# Altium project Power Distribution Board - Componentes teydisa.PrjPcb
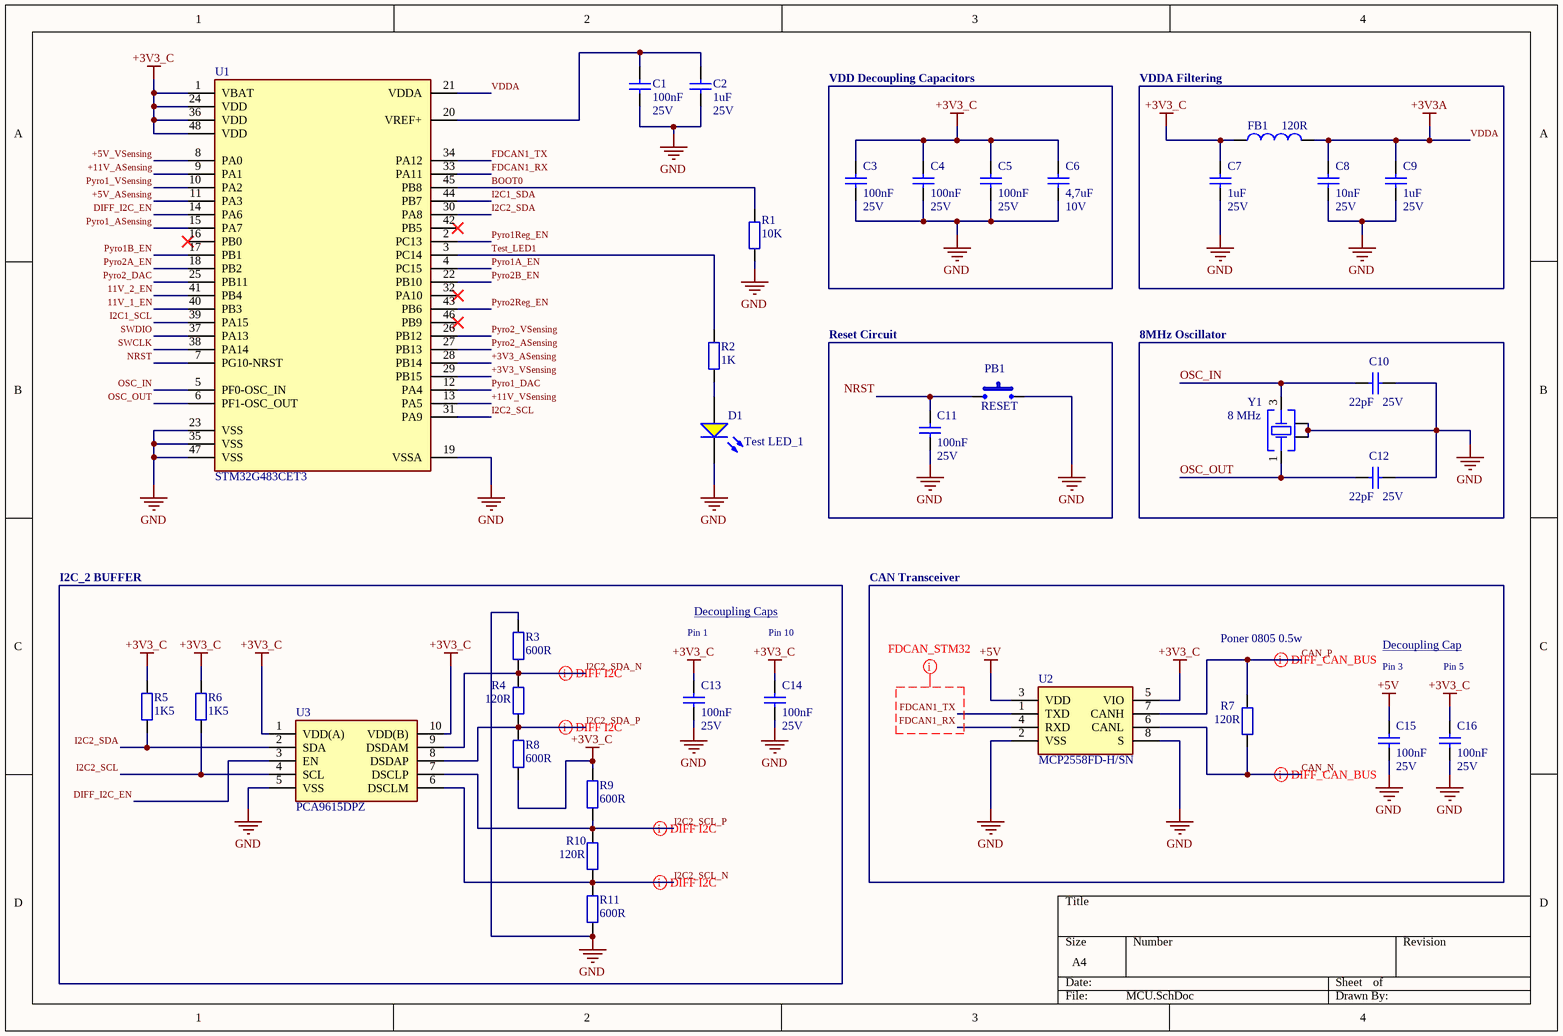
[diagram p0: MCU.SchDoc]
7 sheets, 206 parts. Net scope: global (net labels, ports and power ports of the same name join across sheets).
Board file: PCB_Power_Distribution.PcbDoc
Sheets:
  MCU.SchDoc
  Power Management.SchDoc
  Drogue Pyro.SchDoc
  Main Pyro.SchDoc
  Connectors.SchDoc
  Sensing.SchDoc
  Current Sensing.SchDoc

## Sheet MCU.SchDoc
size A4; SheetNumber: 1; SheetTotal: 7

### Parts
C1  value 100nF  Voltage: 25V  [MY_0603]  (hidden comment: Cap ceramic)
C2  value 1uF  Volte: 25V  [MY_0603]  (hidden comment: Cap ceramic)
C3  value 100nF  Voltage: 25V  [MY_0603]  (hidden comment: Cap ceramic)
C4  value 100nF  Voltage: 25V  [MY_0603]  (hidden comment: Cap ceramic)
C5  value 100nF  Voltage: 25V  [MY_0603]  (hidden comment: Cap ceramic)
C6  value 4,7uF  Volte: 10V  [MY_0603]  (hidden comment: Cap ceramic)
C7  value 1uF  Volte: 25V  [MY_0603]  (hidden comment: Cap ceramic)
C8  25V  value 10nF  [MY_0603]
C9  value 1uF  Volte: 25V  [MY_0603]  (hidden comment: Cap ceramic)
C10  value 22pF  Volte: 25V  [MY_0603]  (hidden comment: Cap ceramic)
C11  value 100nF  Voltage: 25V  [MY_0603]  (hidden comment: Cap ceramic)
C12  value 22pF  Volte: 25V  [MY_0603]  (hidden comment: Cap ceramic)
C13  value 100nF  Voltage: 25V  [MY_0603]  (hidden comment: Cap ceramic)
C14  value 100nF  Voltage: 25V  [MY_0603]  (hidden comment: Cap ceramic)
C15  value 100nF  Voltage: 25V  [MY_0603]  (hidden comment: Cap ceramic)
C16  value 100nF  Voltage: 25V  [MY_0603]  (hidden comment: Cap ceramic)
D1  Test LED_1  [WL-SMCW_0805_150080xx75000]
FB1  120R  [WE-CBF_0603_L1.6W0.8H0.8_HC]
PB1  RESET  [Push Button-Footprint-1]
R1  10K  [R0603-0.45]
R2  1K  [R0603-0.45]
R3  600R  [R0805-0.45]
R4  120R  [R0805-0.45]
R5  1K5  [R0603-0.45]
R6  1K5  [R0603-0.45]
R7  120R  [R0805-0.45]
R8  600R  [R0805-0.45]
R9  600R  [R0805-0.45]
R10  120R  [R0805-0.45]
R11  600R  [R0805-0.45]
U1  STM32G483CET3  [STM32G0C1RET6-Footprint-1]
U2  MCP2558FD-H/SN  [MCP2557FD-H_SN-Footprint-1]
U3  PCA9615DPZ  [PCA9615DPZ-Footprint-1]
Y1  8 MHz  [WE-XTAL_CFPX-104]

### Blocks framed on the sheet
VDD Decoupling Capacitors: C3-C6
VDDA Filtering: C7-C9 FB1
Reset Circuit: C11 PB1
8MHz Oscillator: C10 C12 Y1

### Nets
+3V3_C: C3.2 C4.2 C5.2 C6.2 C7.2 C13.2 C14.2 C16.2 FB1.1 R5.1 R6.1 R8.2 R9.1 U1.1(VBAT) U1.24(VDD) U1.36(VDD) U1.48(VDD) U2.5(VIO) U3.1(VDD(A)) U3.10(VDD(B))
+5V: C15.2 U2.3(VDD)  [project net 5V_Current-]
GND: C1.1 C2.1 C3.1 C4.1 C5.1 C6.1 C7.1 C8.1 C9.1 C10.2 C11.1 C12.2 C13.1 C14.1 C15.1 C16.1 D1.1(K) PB1.2 R1.2 R3.1 R11.2 U1.19(VSSA) U1.23(VSS) U1.35(VSS) U1.47(VSS) U2.2(VSS) U2.8(S) U3.5(VSS) Y1.2(GND_&_Lid) Y1.4(GND_&_Lid)
VDDA: C8.2 C9.2 FB1.2 U1.21(VDDA)  [also labelled +3V3A]
11V_1_EN: U1.40(PB3)
11V_2_EN: U1.41(PB4)
+3V3_ASensing: U1.28(PB14)
+3V3_VSensing: U1.29(PB15)
+5V_ASensing: U1.11(PA3)
+5V_VSensing: U1.8(PA0)
+11V_ASensing: U1.9(PA1)
+11V_VSensing: U1.13(PA5)
BOOT0: R1.1 U1.45(PB8)
CAN_N: R7.1 U2.6(CANL)
CAN_P: R7.2 U2.7(CANH)
DIFF_I2C_EN: U1.14(PA6) U3.3(EN)
FDCAN1_RX: U1.33(PA11) U2.4(RXD)
FDCAN1_TX: U1.34(PA12) U2.1(TXD)
I2C1_SCL: U1.39(PA15)
I2C1_SDA: U1.44(PB7)
I2C2_SCL: R6.2 U1.31(PA9) U3.4(SCL)
I2C2_SCL_N: R10.1 R11.1 U3.6(DSCLM)
I2C2_SCL_P: R9.2 R10.2 U3.7(DSCLP)
I2C2_SDA: R5.2 U1.30(PA8) U3.2(SDA)
I2C2_SDA_N: R3.2 R4.2 U3.9(DSDAM)
I2C2_SDA_P: R4.1 R8.1 U3.8(DSDAP)
NRST: C11.2 PB1.1 U1.7(PG10-NRST)
OSC_IN: C10.1 U1.5(PF0-OSC_IN) Y1.3(Crystal)
OSC_OUT: C12.1 U1.6(PF1-OSC_OUT) Y1.1(Crystal)
Pyro1_ASensing: U1.15(PA7)
Pyro1_DAC: U1.12(PA4)
Pyro1_VSensing: U1.10(PA2)
Pyro1A_EN: U1.4(PC15)
Pyro1B_EN: U1.17(PB1)
Pyro1Reg_EN: U1.2(PC13)
Pyro2_ASensing: U1.27(PB13)
Pyro2_DAC: U1.25(PB11)
Pyro2_VSensing: U1.26(PB12)
Pyro2A_EN: U1.18(PB2)
Pyro2B_EN: U1.22(PB10)
Pyro2Reg_EN: U1.43(PB6)
SWCLK: U1.38(PA14)
SWDIO: U1.37(PA13)
Test_LED1: R2.2 U1.3(PC14)
NetC1_2: C1.2 C2.2 U1.20(VREF+)
NetD1_2: D1.2(A) R2.1

Not connected (* = marked no-connect by the designer): U1 16(PB0)* 32(PA10)* 42(PB5)* 46(PB9)*

### Layout directives
differential pair; differential pair class I2C: I2C2_SCL_N, I2C2_SCL_P, I2C2_SDA_N, I2C2_SDA_P
net class FDCAN_STM32: FDCAN1_RX, FDCAN1_TX
differential pair; differential pair class CAN_BUS: CAN_N, CAN_P

### Notes on the sheet
- I2C_2 BUFFER
- CAN Transceiver
- Pin 1
- Decoupling Caps
- Pin 10
- Poner 0805 0.5w
- Decoupling Cap
- Pin 3
- Pin 5

### Library data of the parts
C1 C3-C5 C11 C13-C16 = CMP-015-000000-1: Capacitor, 100nF, 0603, 25V; Manufacturer: Wurth Elektronik; Manufacturer Part Number: 885012206071
C2 C7 C9 = CMP-015-000000-1: Capacitor, 1uF, 0603, 25V; Manufacturer: Wurth Elektronik; Manufacturer Part Number: 885012206052
C6 = CMP-015-000000-1: Capacitor, 4.7uF, 0603, 25V; Manufacturer: Wurth Elektronik; Manufacturer Part Number: 885012106012
C8 = CMP-015-000000-1: Capacitor, 10nF, 0603, 25V; Manufacturer: Wurth Elektronik; Manufacturer Part Number: 885012206065
C10 C12 = CMP-015-000000-1: Capacitor, 22pF, 0603, 25V; Manufacturer: Wurth Elektronik; Manufacturer Part Number: 885012006034
D1 = CMP-1426-00012-2: LED, 0805, Yellow; NexarPartId: 29717784; Manufacturer: Wurth Elektronik; Manufacturer Part Number: 150080YS75000; Dominant Wavelength: 590nm; Max Reverse Voltage (DC): 5V; Forward Voltage: 2V; Peak Wavelength: 595nm; Max Junction Temperature (Tj): 95°C; Lens Style: Clear, Rectangular; Power Dissipation: 72mW; Test Current: 20mA; Forward Current: 100mA; Luminous Intensity: 120mcd; Viewing Angle: 140°; Min Operating Temperature: -40°C; Case/Package: 0805; REACH SVHC: Unknown; Max Operating Temperature: 85°C; Case Code (Imperial): 0805; Mount: Surface Mount; Packaging: Tape and Reel; RoHS: Compliant; Case Code (Metric): 2012; Reverse Voltage: 5V; Color: Yellow; Height: 700µm; Width: 1.25mm; Wavelength: 590nm; Length: 2mm
FB1 = CMP-0220-00174-3: Ferrite Bead, 120R at 100MHz, 0603, 2 A; Manufacturer: Wurth Elektronik; Manufacturer Part Number: 742792625
PB1 = CMP-010-000001-2: Push Button; Source: IFS_Altium.SchLib; Pin Count: 2; Component Type: Standard; Design Item ID: Push Button
R1 = R: Resistor, 10K, 0603, 0.1W; Manufacturer: Wurth; Manufacturer Part Number: 560112116005; Power Disipation: 0.1W; ClassName: 2PyroREG
R2 = CMP-009-000000-3: Resistor, 1K, 0603, 0.1W; Manufacturer: Wurth; Manufacturer Part Number: 560112116014; Power Disipation: 0.1W
R3 R8 R9 R11 = CMP-009-000000-3: Resistor, 600R, 0805, 0.5W; Manufacturer: Panasonic; Manufacturer Part Number: ERJ-6ENF6040V; Power Disipation: 0.125W
R4 R7 R10 = CMP-009-000000-3: Resistor, 120R, 0805, 0.25W; Manufacturer: Vishay; Manufacturer Part Number: RCS0805120RFKEA; Power Disipation: 0.5W
R5 R6 = CMP-009-000000-3: Resistor, 1.5K, 0603, 0.1W; Manufacturer: Wurth; Manufacturer Part Number: 560112116038; Power Disipation: 0.1W
U1 = CMP-020-00001-5: Microcontroladores ARM (MCU) Mainstream Arm Cortex-M4+ MCU 170MHz 512Kbytes Math Accelerator High Analog; Manufacturer: STMicroelectronics; Manufacturer Part Number: STM32G483CET3
U2 = CMP-00024-00000-3: Interfaz CI CAN CAN FD Transceiver with Silent Mode; Manufacturer: Microchip Technology; Manufacturer Part Number: MCP2558FD-H/SN
U3 = CMP-00024-00001-1: 2 Channel  I2C-busbuffer; Manufacturer: NXP Semiconductors; Manufacturer Part Number: PCA9615DPZ
Y1 = CMP-003-00162-1: WE-XTAL Quartz Crystal, SMT, CFPX-104, 8MHz,; Manufacturer: Wurth Elektronik; Manufacturer Part Number: 830055663; Load Capacitance: 18pF; Length: 5mm; Match Code: WE-XTAL; Frequency: 8MHz; ComponentLink2Description: Datasheet Link; ComponentLink1URL: https://www.we-online.com/redexpert/article/830055663?ad; ComponentLink1Description: Website Link; ComponentLink2URL: https://www.we-online.com/redexpert/spec/830055663?ad

## Sheet Power Management.SchDoc
size A4; SheetNumber: 2; SheetTotal: 7
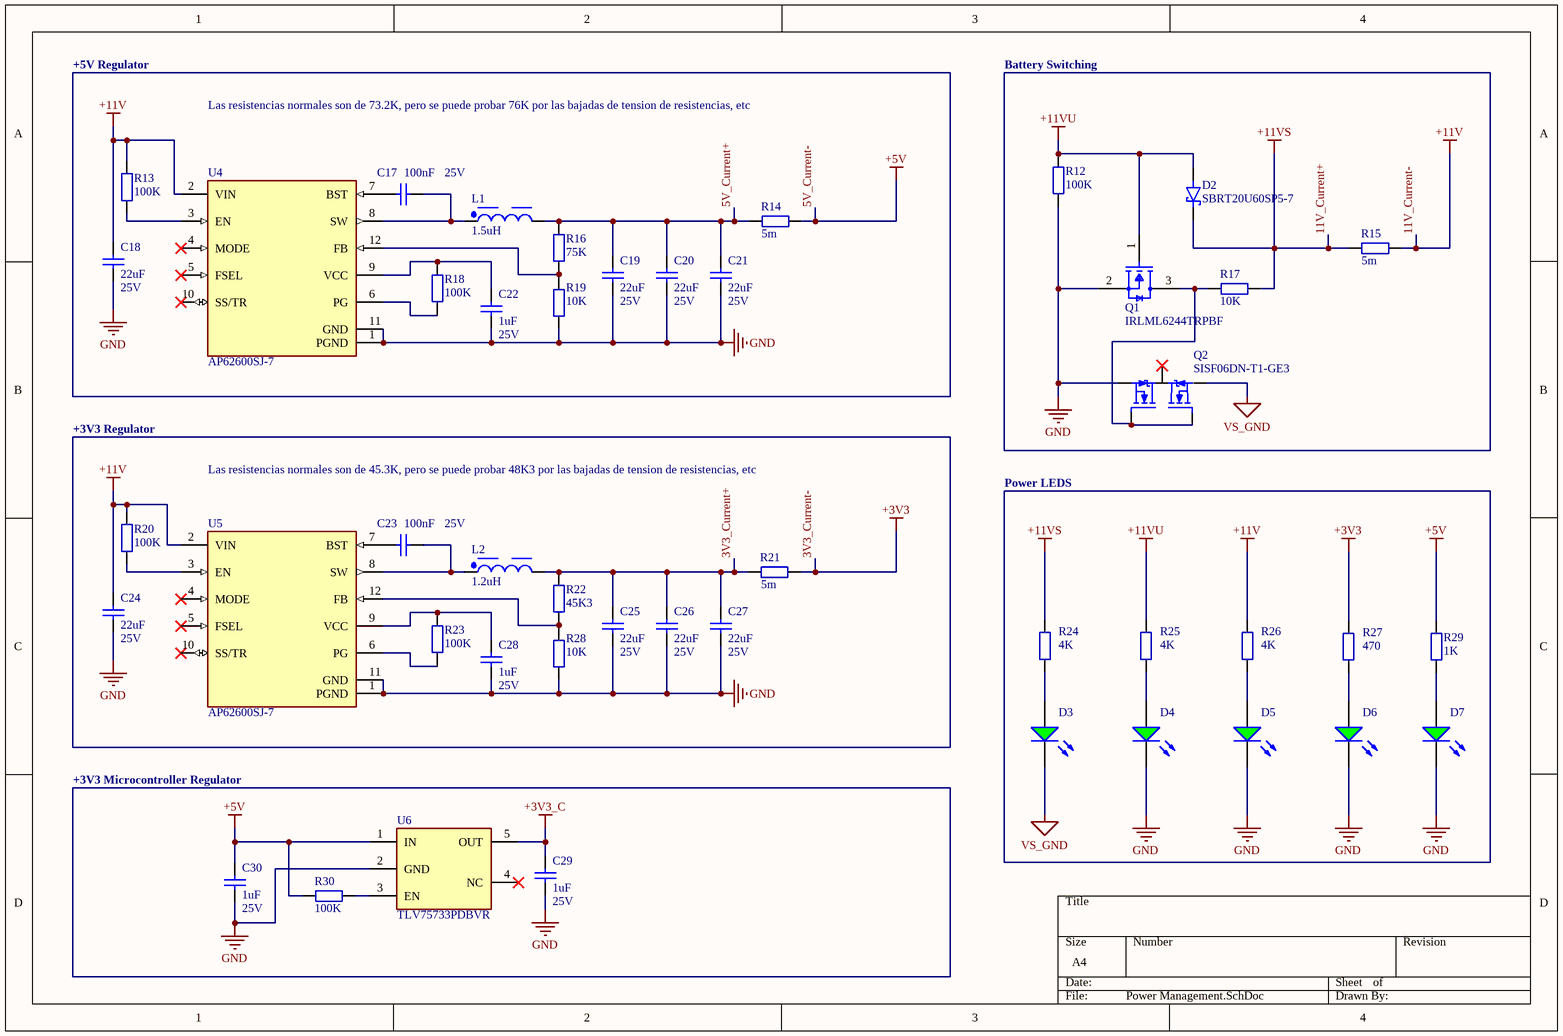
[diagram p1: Power Management.SchDoc]

### Parts
C17  value 100nF  Voltage: 25V  [MY_0603]  (hidden comment: Cap ceramic)
C18  22uF  Voltage: 25V  [MY_0805]
C19  22uF  Voltage: 25V  [MY_0805]
C20  22uF  Voltage: 25V  [MY_0805]
C21  22uF  Voltage: 25V  [MY_0805]
C22  value 1uF  Volte: 25V  [MY_0603]  (hidden comment: Cap ceramic)
C23  value 100nF  Voltage: 25V  [MY_0603]  (hidden comment: Cap ceramic)
C24  22uF  Voltage: 25V  [MY_0805]
C25  22uF  Voltage: 25V  [MY_0805]
C26  22uF  Voltage: 25V  [MY_0805]
C27  22uF  Voltage: 25V  [MY_0805]
C28  value 1uF  Volte: 25V  [MY_0603]  (hidden comment: Cap ceramic)
C29  value 1uF  Volte: 25V  [MY_0603]  (hidden comment: Cap ceramic)
C30  value 1uF  Volte: 25V  [MY_0603]  (hidden comment: Cap ceramic)
D2  SBRT20U60SP5-7  [SBRT20U60SP5-7-Footprint-1]
D3  (no value)  [WL-SMCW_0805_150080xx75000]
D4  (no value)  [WL-SMCW_0805_150080xx75000]
D5  (no value)  [WL-SMCW_0805_150080xx75000]
D6  (no value)  [WL-SMCW_0805_150080xx75000]
D7  (no value)  [WL-SMCW_0805_150080xx75000]
L1  1.5uH  [WE-MAPI_4020]
L2  1.2uH  [WE-MAPI_4020]
Q1  IRLML6244TRPBF  [FP-Micro3-IPC_C]
Q2  SISF06DN-T1-GE3  [SISF06DN-T1-GE3-Footprint-1]
R12  100K  [R0603-0.45]
R13  100K  [R0603-0.45]
R14  5m  [R0612]
R15  5m  [R0612]
R16  75K  [R0603-0.45]
R17  10K  [R0603-0.45]
R18  100K  [R0603-0.45]
R19  10K  [R0603-0.45]
R20  100K  [R0603-0.45]
R21  5m  [R0612]
R22  45K3  [R0603-0.45]
R23  100K  [R0603-0.45]
R24  4K  [R0603-0.45]
R25  4K  [R0603-0.45]
R26  4K  [R0603-0.45]
R27  470  [R0603-0.45]
R28  10K  [R0603-0.45]
R29  1K  [R0603-0.45]
R30  100K  [R0603-0.45]
U4  AP62600SJ-7  [FP-V-QFN2030-12_Type_A-MFG]
U5  AP62600SJ-7  [FP-V-QFN2030-12_Type_A-MFG]
U6  TLV75733PDBVR  [SOT95P280X145-5N]

### Blocks framed on the sheet
+5V Regulator: C17-C22 L1 R13 R14 R16 R18 R19 U4
Battery Switching: D2 Q1 Q2 R12 R15 R17
+3V3 Regulator: C23-C28 L2 R20-R23 R28 U5
Power LEDS: D3-D7 R24-R27 R29
+3V3 Microcontroller Regulator: C29 C30 R30 U6

### Nets
3V3_Current-: R21.2 R27.2  [also labelled +3V3]
5V_Current-: C30.2 R14.2 R29.2 R30.1 U6.1(IN)  [also labelled +5V]
11V_Current+: D2.2 R15.1 R17.2 R24.2  [also labelled +11VS]
11V_Current-: C18.1 C24.1 R13.1 R15.2 R20.1 R26.2 U4.2(VIN) U5.2(VIN)  [also labelled +11V]
+3V3_C: C29.2 U6.5(OUT)
+11VU: D2.1 Q1.1(G) R12.1 R25.2
GND: C18.2 C19.2 C20.2 C21.2 C22.1 C24.2 C25.2 C26.2 C27.2 C28.1 C29.1 C30.1 D4.1(K) D5.1(K) D6.1(K) D7.1(K) Q1.2(S) Q2.4(S1) R12.2 R19.2 R28.2 U4.1(PGND) U4.11(GND) U5.1(PGND) U5.11(GND) U6.2(GND)
VS_GND: D3.1(K) Q2.5(S2)
3V3_Current+: C25.1 C26.1 C27.1 L2.2 R21.1 R22.1
5V_Current+: C19.1 C20.1 C21.1 L1.2 R14.1 R16.1
NetC17_1: C17.1 L1.1 U4.8(SW)
NetC17_2: C17.2 U4.7(BST)
NetC22_2: C22.2 R18.1 U4.9(VCC)
NetC23_1: C23.1 L2.1 U5.8(SW)
NetC23_2: C23.2 U5.7(BST)
NetC28_2: C28.2 R23.1 U5.9(VCC)
NetD3_2: D3.2(A) R24.1
NetD4_2: D4.2(A) R25.1
NetD5_2: D5.2(A) R26.1
NetD6_2: D6.2(A) R27.1
NetD7_2: D7.2(A) R29.1
NetQ1_3: Q1.3(D) Q2.1(G1) Q2.3(G2) R17.1
NetR13_2: R13.2 U4.3(EN)
NetR16_2: R16.2 R19.1 U4.12(FB)
NetR18_2: R18.2 U4.6(PG)
NetR20_2: R20.2 U5.3(EN)
NetR22_2: R22.2 R28.1 U5.12(FB)
NetR23_2: R23.2 U5.6(PG)
NetR30_2: R30.2 U6.3(EN)

Not connected (* = marked no-connect by the designer): Q2 2(D)*; U4 4(MODE)* 5(FSEL)* 10(SS/TR)*; U5 4(MODE)* 5(FSEL)* 10(SS/TR)*; U6 4(NC)*

### Notes on the sheet
- Las resistencias normales son de 73.2K, pero se puede probar 76K por las bajadas de tension de resistencias, etc
- Las resistencias normales son de 45.3K, pero se puede probar 48K3 por las bajadas de tension de resistencias, etc

### Library data of the parts
C17 C23 = CMP-015-000000-1: as C1 on sheet MCU
  C17: ClassName: REG5V
  C23: ClassName: REG3V3
C18-C21 C24 = CMP-015-000000-1: Capacitor, 22uF, 0805, 25V; Manufacturer: Samsung; Manufacturer Part Number: CL21A226MAYNNNE; ClassName: REG5V
C22 C28-C30 = CMP-015-000000-1: as C2 on sheet MCU
  C22: ClassName: REG5V
  C28: ClassName: REG3V3
C25-C27 = CMP-015-000000-1: None polar capacitor; Manufacturer: Samsung; Manufacturer Part Number: CL21A226MAYNNNE; ClassName: REG5V
D2 = CMP-004-00009-1: Rectifier Diode, 1 Phase, 1 Element, 20A, 60V V(RRM), Silicon; Manufacturer: Diodes Incorporated; Manufacturer Part Number: SBRT20U60SP5-7
D3-D7 = CMP-1426-00007-2: LED, 0805, Green; Manufacturer: Wurth Elektronik; Manufacturer Part Number: 150080GS75000
L1 = CMP-03913-66963831-2: 74438356015 Fixed Ind 1.5UH 5.8A 19 Mohm SMD; Manufacturer: Wurth Elektronik; Manufacturer Part Number: 74438356015; ClassName: REG5V
L2 = CMP-207846-000036-3: FIXED IND 1.2UH 5.8A 18 MOHM SMD; Manufacturer: Wurth Elektronik; Manufacturer Part Number: 74438356012; ClassName: REG3V3
Q1 = CMP-013-00010-1: Power Field-Effect Transistor, 6.3A I(D), 20V, 0.021ohm, 1-Element, N-Channel, Silicon, Metal-oxide Semiconductor FET, TO-236AB; RoHS Compliant: Yes; Max Operating Temperature: 150°C; Pins: 3
Q2 = CMP-013-00009-3: Power Field-Effect Transistor, 101A I(D), 30V, 0.0045ohm, 2-Element, N-Channel, Silicon, Metal-oxide Semiconductor FET; RoHS Compliant: Yes
R12 R13 R18 R20 R23 = R: Resistor, 100K, 0603, 0.1W; Manufacturer: Wurth; Manufacturer Part Number: 560112116004; Power Disipation: 0.1W; ClassName: REG5V
R14 R15 R21 = CMP-009-000000-6: Resistor, 5m, 0612, 2W; Manufacturer: Vishay; Manufacturer Part Number: WFCP06125L000FE66
  R14: ClassName: 5V OPAMP
  R15: ClassName: 11V OPAMP
  R21: ClassName: 3V3 OPAMP
R16 = R: Resistor, 75K, 0603, 0.1W; Manufacturer: Wurth; Manufacturer Part Number: 560112110261; Power Disipation: 0.1W; ClassName: REG5V
R17 R19 R28 = R: as R1 on sheet MCU; Power Disipation: 0.1W; ClassName: 2PyroREG
R22 = R: Resistor, 45.3kK, 0603, 0.1W; Manufacturer: Wurth; Manufacturer Part Number: 560112110243; Power Disipation: 0.1W; ClassName: REG3V3
R24-R26 = CMP-009-000000-3: Resistor, 4K, 0603, 0.1W; Manufacturer: Wurth; Manufacturer Part Number: 560112116093; Power Disipation: 0.1W
R27 = CMP-009-000000-3: Resistor, 470K, 0603, 0.1W; Manufacturer: Wurth; Manufacturer Part Number: 560112116067; Power Disipation: 0.1W
R29 = CMP-009-000000-3: Resistor, 1kK, 0603, 0.1W; Manufacturer: Wurth; Manufacturer Part Number: 560112116014; Power Disipation: 0.1W
R30 = R: Resistor, 75K, 0603, 0.1W; Manufacturer: Wurth; Manufacturer Part Number: 560112116004; Power Disipation: 0.1W; ClassName: REG5V
U4 U5 = CMP-012-00004-1: Switching Regulator, 1200kHz Switching Freq-Max; Manufacturer: Diodes Incorporated; Manufacturer Part Number: AP62600SJ-7
  U4: ClassName: REG5V
  U5: ClassName: REG3V3
U6 = CMP-087-000000-3: LDO Voltage Regulators 1A Low-IQ Small-Size Low-Dropout (LDO) Regulator 5-SOT-23 -40 to 125; Manufacturer: Texas Instruments; Manufacturer Part Number: TLV75733PDBVR

## Sheet Drogue Pyro.SchDoc
size A4; SheetNumber: 3; SheetTotal: 7
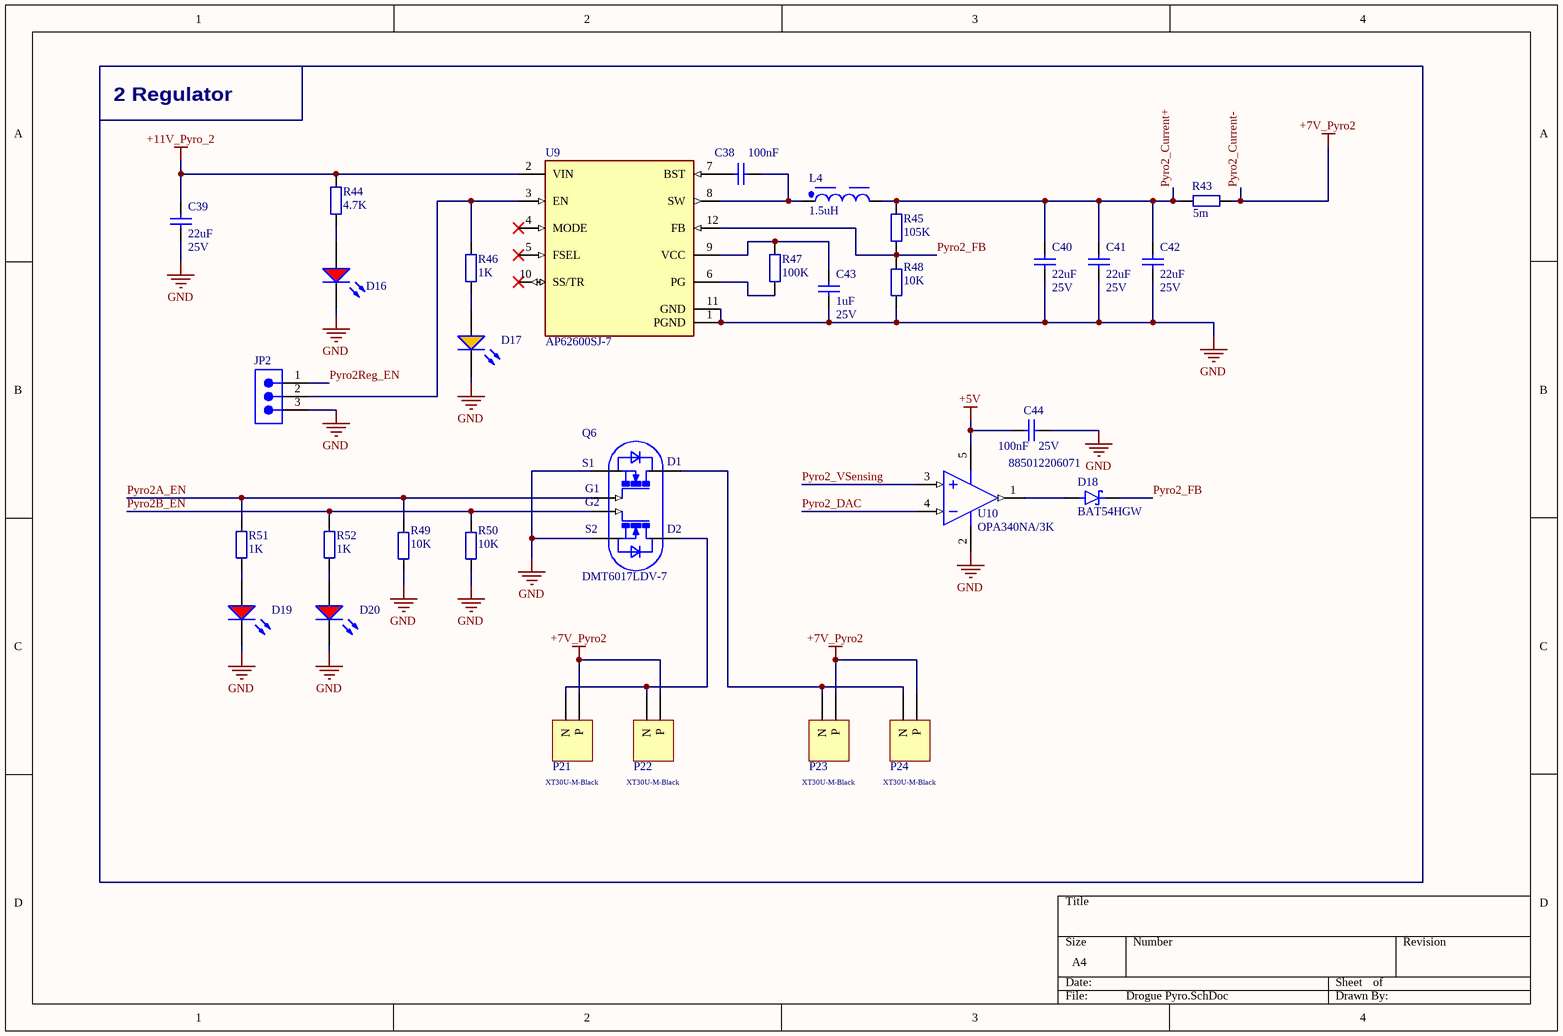
[diagram p2: Drogue Pyro.SchDoc]

### Parts
C38  value 100nF  [MY_0603]  (hidden comment: Cap ceramic)
C39  22uF  Voltage: 25V  [MY_0805]
C40  22uF  Voltage: 25V  [MY_0805]
C41  22uF  Voltage: 25V  [MY_0805]
C42  22uF  Voltage: 25V  [MY_0805]
C43  value 1uF  Volte: 25V  [MY_0603]  (hidden comment: Cap ceramic)
C44  value 100nF  Voltage: 25V  Manufacturer Part Number: 885012206071  [MY_0603]  (hidden comment: Cap ceramic)
D16  150080RS75000  [WL-SMCW_0805_150080xx75000]  (value not drawn)
D17  150080AS75000  [WL-SMCW_0805_150080xx75000]  (value not drawn)
D18  BAT54HGW  [BAT54HGW-Footprint-1]
D19  150080RS75000  [WL-SMCW_0805_150080xx75000]  (value not drawn)
D20  150080RS75000  [WL-SMCW_0805_150080xx75000]  (value not drawn)
JP2  Jumper 3 pin, 2,54mm  [Jumper 3 pin, 2,54mm-Footprint-1]  (value not drawn)
L4  1.5uH  [WE-MAPI_4020]
P21  XT30U-M-Black  [XT30-Footprint-2]
P22  XT30U-M-Black  [XT30-Footprint-2]
P23  XT30U-M-Black  [XT30-Footprint-2]
P24  XT30U-M-Black  [XT30-Footprint-2]
Q6  DMT6017LDV-7  [DMT6017LDV-7-Footprint-1]
R43  5m  [R0612]
R44  4.7K  [R0603-0.45]
R45  105K  [R0603-0.45]
R46  1K  [R0603-0.45]
R47  100K  [R0603-0.45]
R48  10K  [R0603-0.45]
R49  10K  [R0603-0.45]
R50  10K  [R0603-0.45]
R51  1K  [R0603-0.45]
R52  1K  [R0603-0.45]
U9  AP62600SJ-7  [FP-V-QFN2030-12_Type_A-MFG]
U10  OPA340NA/3K  [DBV0005A_M]

### Blocks framed on the sheet
2 Regulator: C38-C44 D16-D20 JP2 L4 P21-P24 Q6 R43-R52 U9 U10

### Nets
+5V: C44.2 U10.5(V+)  [project net 5V_Current-]
+11V_Pyro_2: C39.1 R44.2 U9.2(VIN)
GND: C39.2 C40.2 C41.2 C42.2 C43.1 C44.1 D16.1(K) D17.1(K) D19.1(K) D20.1(K) JP2.3 Q6.1(S1) Q6.3(S2) R48.2 R49.2 R50.2 U9.1(PGND) U9.11(GND) U10.2(V-)
Pyro2_Current-: P21.P P22.P P23.P P24.P R43.2  [also labelled +7V_Pyro2]
Pyro2_Current+: C40.1 C41.1 C42.1 L4.2 R43.1 R45.1
Pyro2_DAC: U10.4(IN-)
Pyro2_FB: D18.C(K) R45.2 R48.1 U9.12(FB)
Pyro2_VSensing: U10.3(IN+)
Pyro2A_EN: Q6.2(G1) R49.1 R51.2
Pyro2B_EN: Q6.4(G2) R50.1 R52.2
Pyro2Reg_EN: JP2.1
NetC38_1: C38.1 L4.1 U9.8(SW)
NetC38_2: C38.2 U9.7(BST)
NetC43_2: C43.2 R47.1 U9.9(VCC)
NetD16_2: D16.2(A) R44.1
NetD17_2: D17.2(A) R46.1
NetD18_A: D18.A U10.1(OUT)
NetD19_2: D19.2(A) R51.1
NetD20_2: D20.2(A) R52.1
NetJP2_2: JP2.2 R46.2 U9.3(EN)
NetP21_N: P21.N P22.N Q6.6(D2)
NetP23_N: P23.N P24.N Q6.8(D1)
NetR47_2: R47.2 U9.6(PG)

Not connected (* = marked no-connect by the designer): U9 4(MODE)* 5(FSEL)* 10(SS/TR)*

### Library data of the parts
C38 = CMP-015-000000-1: as C1 on sheet MCU; Voltage: 25V; ClassName: 2PyroREG
C39-C42 = CMP-015-000000-1: as C18 on sheet Power Management; ClassName: REG5V
C43 = CMP-015-000000-1: as C2 on sheet MCU; ClassName: 2PyroREG
C44 = CMP-015-000000-1: Capacitor, 100nF, 0603, 25V; Manufacturer: Wurth Elektronik; ClassName: 1Pyro OPAMP
D16 D19 D20 = CMP-1426-00011-2: LED, 0805, Red; NexarPartId: 29717781; Manufacturer: Wurth Elektronik; Peak Wavelength: 630nm; Wavelength: 625nm; Viewing Angle: 140°; Test Current: 20mA; Forward Voltage: 2V; Forward Current: 100mA; Lens Style: Clear, Rectangular; Luminous Intensity: 150mcd; Max Reverse Voltage (DC): 5V; Length: 2mm; Case Code (Imperial): 0805; RoHS: Compliant; Max Operating Temperature: 85°C; Height: 700µm; Packaging: Tape and Reel; Color: Red; Case/Package: 0805; REACH SVHC: Unknown; Dominant Wavelength: 625nm; Min Operating Temperature: -40°C; Case Code (Metric): 2012; Mount: Surface Mount; Width: 1.25mm; Manufacturer Part Number: 150080RS75000
D17 = CMP-03913-89970695-1: Amber; Manufacturer: Wurth Elektronik; Manufacturer Part Number: 150080AS75000
D18 = CMP-100-000001-3: BAT54HGW Schotty Diode; Manufacturer: Nexperia; Manufacturer Part Number: BAT54HGW
JP2 = CMP-002-00265-1
L4 = CMP-03913-66963831-2: as L1 on sheet Power Management; Manufacturer Part Number: 74438356015; ClassName: 2PyroREG
P21-P24 = CMP-002-00004-11: XT30PW-M公头 Socket,DCsupply,XT30,male,PIN:2; Manufacturer: AMASS; Manufacturer Part Number: XT30U-M-Black
Q6 = CMP-013-00011-1: Small Signal Field-Effect Transistor; RoHS Compliant: Yes
R43 = CMP-009-000000-6: as R14 on sheet Power Management; ClassName: 2Pyro OPAMP
R44 = CMP-009-000000-3: Resistor, 4.7K, 0603, 0.1W; Manufacturer: Wurth; Manufacturer Part Number: 560112116006; Power Disipation: 0.1W
R45 = R: Resistor, 105K, 0603, 0.1W; Manufacturer: Wurth; Manufacturer Part Number: 560112110183; Power Disipation: 0.1W; ClassName: 2PyroREG
R46 R51 R52 = CMP-009-000000-3: as R2 on sheet MCU; Power Disipation: 0.1W
R47 = R: as R12 on sheet Power Management; Power Disipation: 0.1W; ClassName: REG5V
R48-R50 = R: as R1 on sheet MCU; Power Disipation: 0.1W
  R48 R49: ClassName: 2PyroREG
  R50: ClassName: DroguePyroREG
U9 = CMP-012-00004-1: as U4 on sheet Power Management; Manufacturer Part Number: AP62600SJ-7; ClassName: 2PyroREG
U10 = CMP-0272-00929-3: Single-Supply, Rail-to-Rail Operational Amplifier MicroAmplifier(TM) Series, 2.7 to 5.5 V, -40 to 85 degC, 5-pin SOT23 (DBV5), Green (RoHS & no Sb/Br); Manucaturer: Texas Instruments; ComponentLink3URL: http://www.ti.com/litv/pdf/mpds018i; ComponentLink1Description: Manufacturer URL; ComponentLink1URL: http://www.ti.com/; ComponentLink3Description: Package Specification; ComponentLink2URL: http://www.ti.com/general/docs/lit/getliterature.tsp?genericPartNumber=OPA340&fileType=pdf; ComponentLink2Description: Datasheet; Manufacturer Part Number: OPA340NA/3K

## Sheet Main Pyro.SchDoc
size A4; SheetNumber: 4; SheetTotal: 7
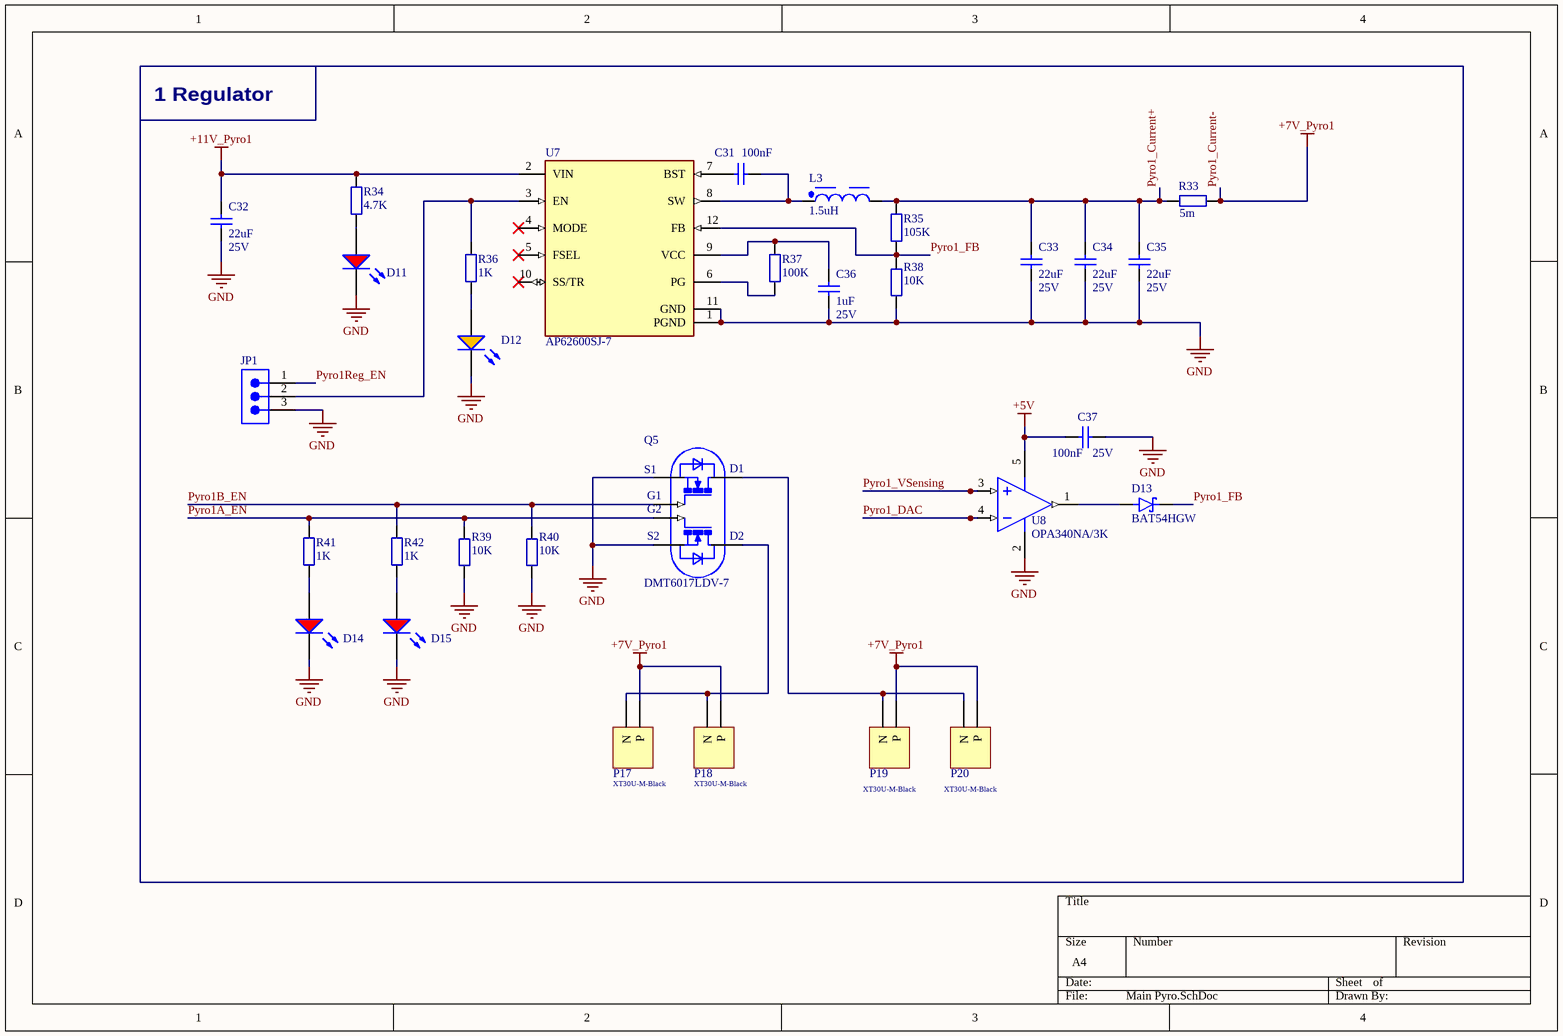
[diagram p3: Main Pyro.SchDoc]

### Parts
C31  value 100nF  [MY_0603]  (hidden comment: Cap ceramic)
C32  22uF  Voltage: 25V  [MY_0805]
C33  22uF  Voltage: 25V  [MY_0805]
C34  22uF  Voltage: 25V  [MY_0805]
C35  22uF  Voltage: 25V  [MY_0805]
C36  value 1uF  Volte: 25V  [MY_0603]  (hidden comment: Cap ceramic)
C37  value 100nF  Voltage: 25V  [MY_0603]  (hidden comment: Cap ceramic)
D11  150080RS75000  [WL-SMCW_0805_150080xx75000]  (value not drawn)
D12  150080AS75000  [WL-SMCW_0805_150080xx75000]  (value not drawn)
D13  BAT54HGW  [BAT54HGW-Footprint-1]
D14  150080RS75000  [WL-SMCW_0805_150080xx75000]  (value not drawn)
D15  150080RS75000  [WL-SMCW_0805_150080xx75000]  (value not drawn)
JP1  Jumper 3 pin, 2,54mm  [Jumper 3 pin, 2,54mm-Footprint-1]  (value not drawn)
L3  1.5uH  [WE-MAPI_4020]
P17  XT30U-M-Black  [XT30-Footprint-2]
P18  XT30U-M-Black  [XT30-Footprint-2]
P19  XT30U-M-Black  [XT30-Footprint-2]
P20  XT30U-M-Black  [XT30-Footprint-2]
Q5  DMT6017LDV-7  [DMT6017LDV-7-Footprint-1]
R33  5m  [R0612]
R34  4.7K  [R0603-0.45]
R35  105K  [R0603-0.45]
R36  1K  [R0603-0.45]
R37  100K  [R0603-0.45]
R38  10K  [R0603-0.45]
R39  10K  [R0603-0.45]
R40  10K  [R0603-0.45]
R41  1K  [R0603-0.45]
R42  1K  [R0603-0.45]
U7  AP62600SJ-7  [FP-V-QFN2030-12_Type_A-MFG]
U8  OPA340NA/3K  [DBV0005A_M]

### Blocks framed on the sheet
1 Regulator: C31-C37 D11-D15 JP1 L3 P17-P20 Q5 R33-R42 U7 U8

### Nets
+5V: C37.2 U8.5(V+)  [project net 5V_Current-]
+11V_Pyro1: C32.1 R34.2 U7.2(VIN)
GND: C32.2 C33.2 C34.2 C35.2 C36.1 C37.1 D11.1(K) D12.1(K) D14.1(K) D15.1(K) JP1.3 Q5.1(S1) Q5.3(S2) R38.2 R39.2 R40.2 U7.1(PGND) U7.11(GND) U8.2(V-)
Pyro1_Current-: P17.P P18.P P19.P P20.P R33.2  [also labelled +7V_Pyro1]
Pyro1_Current+: C33.1 C34.1 C35.1 L3.2 R33.1 R35.1
Pyro1_DAC: U8.4(IN-)
Pyro1_FB: D13.C(K) R35.2 R38.1 U7.12(FB)
Pyro1_VSensing: U8.3(IN+)
Pyro1A_EN: Q5.4(G2) R39.1 R41.2
Pyro1B_EN: Q5.2(G1) R40.1 R42.2
Pyro1Reg_EN: JP1.1
NetC31_1: C31.1 L3.1 U7.8(SW)
NetC31_2: C31.2 U7.7(BST)
NetC36_2: C36.2 R37.1 U7.9(VCC)
NetD11_2: D11.2(A) R34.1
NetD12_2: D12.2(A) R36.1
NetD13_A: D13.A U8.1(OUT)
NetD14_2: D14.2(A) R41.1
NetD15_2: D15.2(A) R42.1
NetJP1_2: JP1.2 R36.2 U7.3(EN)
NetP17_N: P17.N P18.N Q5.6(D2)
NetP19_N: P19.N P20.N Q5.8(D1)
NetR37_2: R37.2 U7.6(PG)

Not connected (* = marked no-connect by the designer): U7 4(MODE)* 5(FSEL)* 10(SS/TR)*

### Library data of the parts
C31 C37 = CMP-015-000000-1: as C1 on sheet MCU
  C31: Voltage: 25V; ClassName: 1PyroREG
  C37: ClassName: 1Pyro OPAMP
C32-C35 = CMP-015-000000-1: as C18 on sheet Power Management; ClassName: REG5V
C36 = CMP-015-000000-1: as C2 on sheet MCU; ClassName: 1PyroREG
D11 = CMP-1426-00011-2: as D16 on sheet Drogue Pyro; Length: 2mm; Case Code (Imperial): 0805; RoHS: Compliant; Max Operating Temperature: 85°C; Height: 700µm; Packaging: Tape and Reel; Color: Red; Case/Package: 0805; REACH SVHC: Unknown; Dominant Wavelength: 625nm; Min Operating Temperature: -40°C; Case Code (Metric): 2012; Mount: Surface Mount; Width: 1.25mm; Manufacturer Part Number: 150080RS75000
D12 = CMP-03913-89970695-1: LED, 0805, Amber; Manufacturer: Wurth Elektronik; Manufacturer Part Number: 150080AS75000
D13 = CMP-100-000001-3: as D18 on sheet Drogue Pyro; Manufacturer Part Number: BAT54HGW
D14 D15 = CMP-1426-00011-2: NexarPartId: 29717781; Manufacturer: Wurth Elektronik; Peak Wavelength: 630nm; Wavelength: 625nm; Viewing Angle: 140°; Test Current: 20mA; Forward Voltage: 2V; Forward Current: 100mA; Lens Style: Clear, Rectangular; Color: Red; Luminous Intensity: 150mcd; Max Reverse Voltage (DC): 5V; Length: 2mm; Case Code (Imperial): 0805; RoHS: Compliant; Max Operating Temperature: 85°C; Height: 700µm; Packaging: Tape and Reel; Case/Package: 0805; REACH SVHC: Unknown; Dominant Wavelength: 625nm; Min Operating Temperature: -40°C; Case Code (Metric): 2012; Mount: Surface Mount; Width: 1.25mm; Manufacturer Part Number: 150080RS75000
JP1 = CMP-002-00265-1
L3 = CMP-03913-66963831-2: as L1 on sheet Power Management; Manufacturer Part Number: 74438356015; ClassName: 1PyroREG
P17-P20 = CMP-002-00004-11: as P21 on sheet Drogue Pyro; Manufacturer Part Number: XT30U-M-Black
Q5 = CMP-013-00011-1: Small Signal Field-Effect Transistor; RoHS Compliant: Yes
R33 = CMP-009-000000-6: as R14 on sheet Power Management; ClassName: 1Pyro OPAMP
R34 = CMP-009-000000-3: as R44 on sheet Drogue Pyro; Power Disipation: 0.1W
R35 = R: as R45 on sheet Drogue Pyro; Power Disipation: 0.1W; ClassName: 1PyroREG
R36 R41 R42 = CMP-009-000000-3: as R2 on sheet MCU; Power Disipation: 0.1W
R37 = R: as R12 on sheet Power Management; Power Disipation: 0.1W; ClassName: REG5V
R38-R40 = R: Resistor, 10K, 0603, 0.1W; Manufacturer: Vishay; Manufacturer Part Number: RCS060310K0FKEA; Power Disipation: 0.25W
  R38 R39: ClassName: 1PyroREG
  R40: ClassName: MainPyroREG
U7 = CMP-012-00004-1: as U4 on sheet Power Management; Manufacturer Part Number: AP62600SJ-7; ClassName: 1PyroREG
U8 = CMP-0272-00929-3: Single-Supply, Rail-to-Rail Operational Amplifier MicroAmplifier(TM) Series, 2.7 to 5.5 V, -40 to 85 degC, 5-pin SOT23 (DBV5), Green (RoHS & no Sb/Br); Manufacturer: Texas Instruments; ComponentLink3URL: http://www.ti.com/litv/pdf/mpds018i; ComponentLink1Description: Manufacturer URL; ComponentLink1URL: http://www.ti.com/; ComponentLink3Description: Package Specification; ComponentLink2URL: http://www.ti.com/general/docs/lit/getliterature.tsp?genericPartNumber=OPA340&fileType=pdf; ComponentLink2Description: Datasheet; Manufacturer Part Number: OPA340NA/3K

## Sheet Connectors.SchDoc
size A4; SheetNumber: 5; SheetTotal: 7
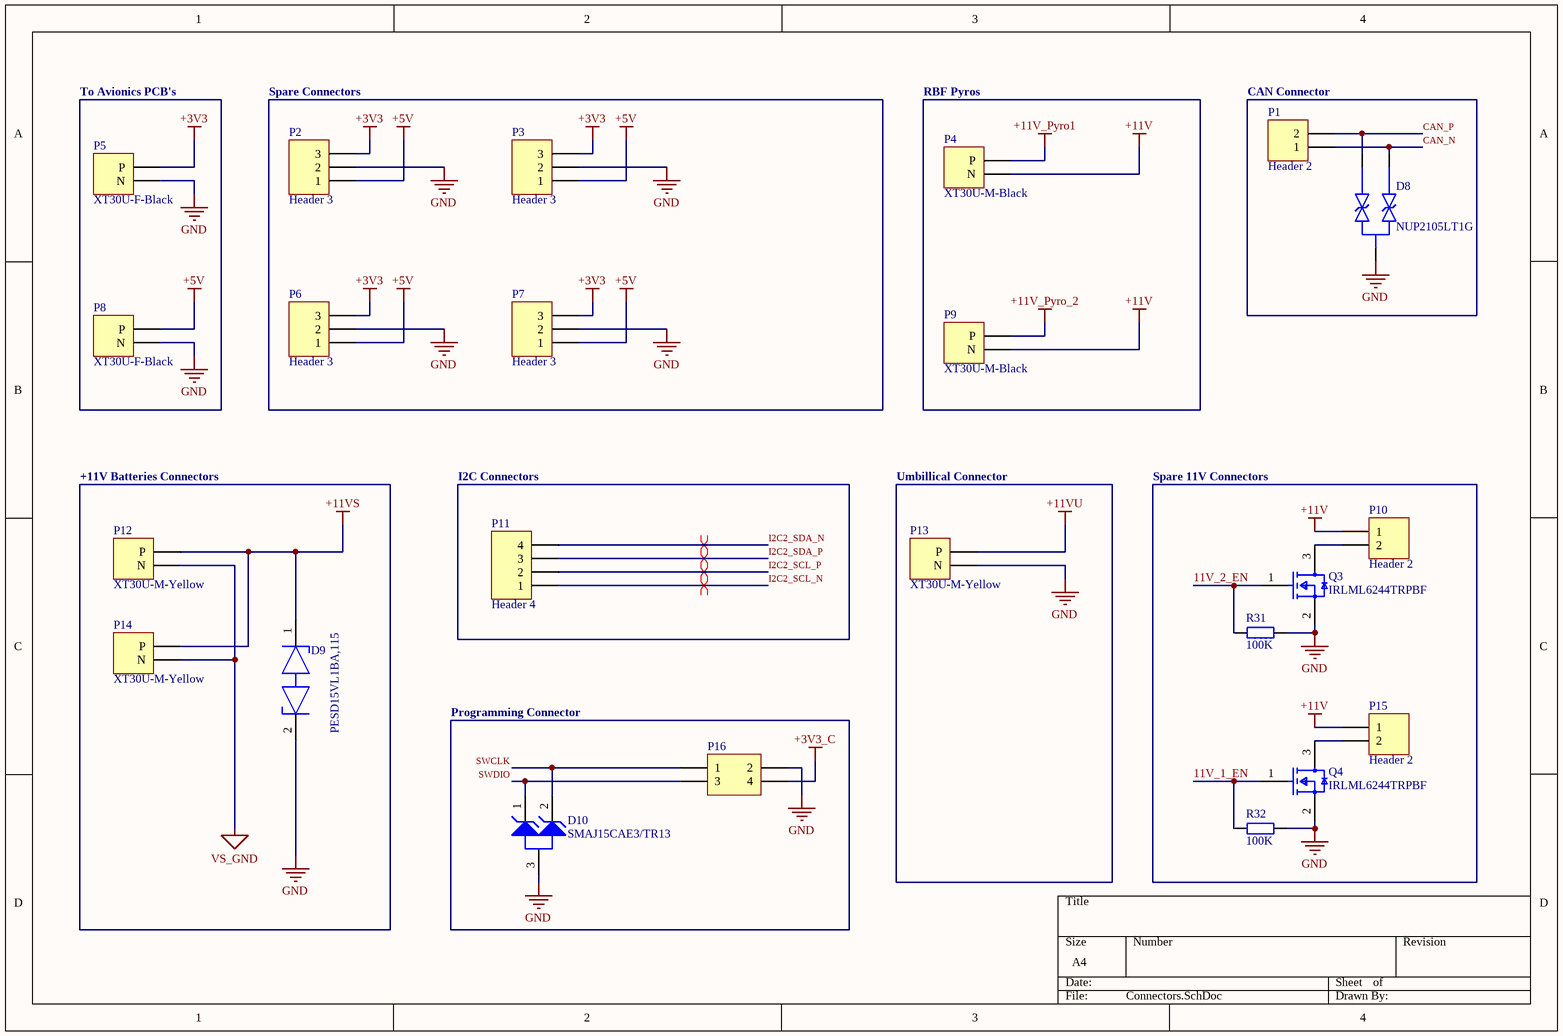
[diagram p4: Connectors.SchDoc]

### Parts
D8  NUP2105LT1G  [NUP2105LT1G-Footprint-1]
D9  PESD15VL1BA,115  [FP-SOD323-CA-IPC_C]
D10  SMAJ15CAE3/TR13  [ONSC-SOT-723-3-631AA-01_V]
P1  Header 2  [JST XH 2]
P2  Header 3  [JST XH 3]
P3  Header 3  [JST XH 3]
P4  XT30U-M-Black  [XT30-Footprint-2]
P5  XT30U-F-Black  [XT30-Footprint-1]
P6  Header 3  [JST XH 3]
P7  Header 3  [JST XH 3]
P8  XT30U-F-Black  [XT30-F Negro]
P9  XT30U-M-Black  [XT30-Footprint-2]
P10  Header 2  [JST XH 2]
P11  Header 4  [JST XH]
P12  XT30U-M-Yellow  [XT30-Footprint-2]
P13  XT30U-M-Yellow  [XT30-Footprint-2]
P14  XT30U-M-Yellow  [XT30-Footprint-2]
P15  Header 2  [JST XH 2]
P16  2 Row 2.54mm Pin Header  [My_2X02]  (value not drawn)
Q3  IRLML6244TRPBF  [FP-Micro3-IPC_C]
Q4  IRLML6244TRPBF  [FP-Micro3-IPC_C]
R31  100K  [R0603-0.45]
R32  100K  [R0603-0.45]

### Blocks framed on the sheet
To Avionics PCB's: P5 P8
Spare Connectors: P2 P3 P6 P7
RBF Pyros: P4 P9
CAN Connector: D8 P1
+11V Batteries Connectors: D9 P12 P14
I2C Connectors: P11
Umbillical Connector: P13
Spare 11V Connectors: P10 P15 Q3 Q4 R31 R32
Programming Connector: D10 P16

### Nets
+3V3: P2.3 P3.3 P5.P P6.3 P7.3  [project net 3V3_Current-]
+3V3_C: P16.4
+5V: P2.1 P3.1 P6.1 P7.1 P8.P  [project net 5V_Current-]
+11V: P4.N P9.N P10.1 P15.1  [project net 11V_Current-]
+11V_Pyro1: P4.P
+11V_Pyro_2: P9.P
+11VS: D9.1 P12.P P14.P  [project net 11V_Current+]
+11VU: P13.P
GND: D8.3 D9.2 D10.3(A) P2.2 P3.2 P5.N P6.2 P7.2 P8.N P13.N P16.2 Q3.2(S) Q4.2(S) R31.2 R32.2
VS_GND: P12.N P14.N
11V_1_EN: Q4.1(G) R32.1
11V_2_EN: Q3.1(G) R31.1
CAN_N: D8.1 P1.1
CAN_P: D8.2 P1.2
I2C2_SCL_N: P11.1
I2C2_SCL_P: P11.2
I2C2_SDA_N: P11.4
I2C2_SDA_P: P11.3
SWCLK: D10.2(K2) P16.1
SWDIO: D10.1(K1) P16.3
NetP10_2: P10.2 Q3.3(D)
NetP15_2: P15.2 Q4.3(D)

### Layout directives
differential pair: I2C2_SCL_N, I2C2_SCL_P, I2C2_SDA_N, I2C2_SDA_P

### Library data of the parts
D8 = CMP-004-00006-2: Supresor de ESD / diodos TVS 27V CAN BUS Protection; Manufacturer: Onsemi; Manufacturer Part Number: NUP2105LT1G; Case/Package: None; Pins: 3
D9 = CMP-14432-000007-1: TVS DIODE 15VWM 44VC SOD323; Manufacturer: Nexperia; Manufacturer Part Number: PESD15VL1BA,115
D10 = CMP-004-00007-1: Supresores de ESD / diodos TVS TVS 400W, Stand-off voltage = 15V, +/- 5%, Bi-dir; Manufacturer: Micochip Technology; Manufacturer Part Number: SMAJ15CAE3/TR13
P1 P10 P15 = CMP-016-000011-6: Header, 2-Pin; ASiD Part Number: Header 2-AS; Signal Integrity: Connector; Design Item ID: Header 2; Pin Count: 2; Component Type: Standard; Source: PCB_Project1.SCHLIB
P2 P3 P6 P7 = CMP-016-000017-5: Header, 3-Pin; ASiD Part Number: Header 3-AS; Signal Integrity: Connector; Pin Count: 3; Design Item ID: Header 3; Component Type: Standard; Source: PCB_Project1.SCHLIB
P4 P8 P9 = CMP-002-00004-11: as P21 on sheet Drogue Pyro
  P4 P9: Manufacturer Part Number: XT30U-M-Black
  P8: Manufacturer Part Number: XT30U-F-Black
P5 = CMP-002-00004-7: XT30PW-M公头 Socket,DCsupply,XT30,male,PIN:2; Manufacturer: AMASS; Manufacturer Part Number: XT30U-F-Yellow
P11 = CMP-016-000019-4: Header, 4-Pin; ASiD Part Number: Header 4-AS; Signal Integrity: Connector; Design Item ID: Header 4; Source: PCB_Project1.SCHLIB; Pin Count: 4; Component Type: Standard
P12-P14 = CMP-002-00004-7: XT30PW-M公头 Socket,DCsupply,XT30,male,PIN:2; Manufacturer: AMASS; Manufacturer Part Number: XT30U-M-Yellow
P16 = CMP-016-000016-1: Header, 2-Pin, Dual row; Manufacturer: *; Manufacturer Part Number: *
Q3 Q4 = CMP-013-00010-1: as Q1 on sheet Power Management; RoHS Compliant: Yes; Max Operating Temperature: 150°C; Pins: 3
R31 R32 = R: as R12 on sheet Power Management; Power Disipation: 0.1W; ClassName: REG5V

## Sheet Sensing.SchDoc
size A4; SheetNumber: 6; SheetTotal: 7
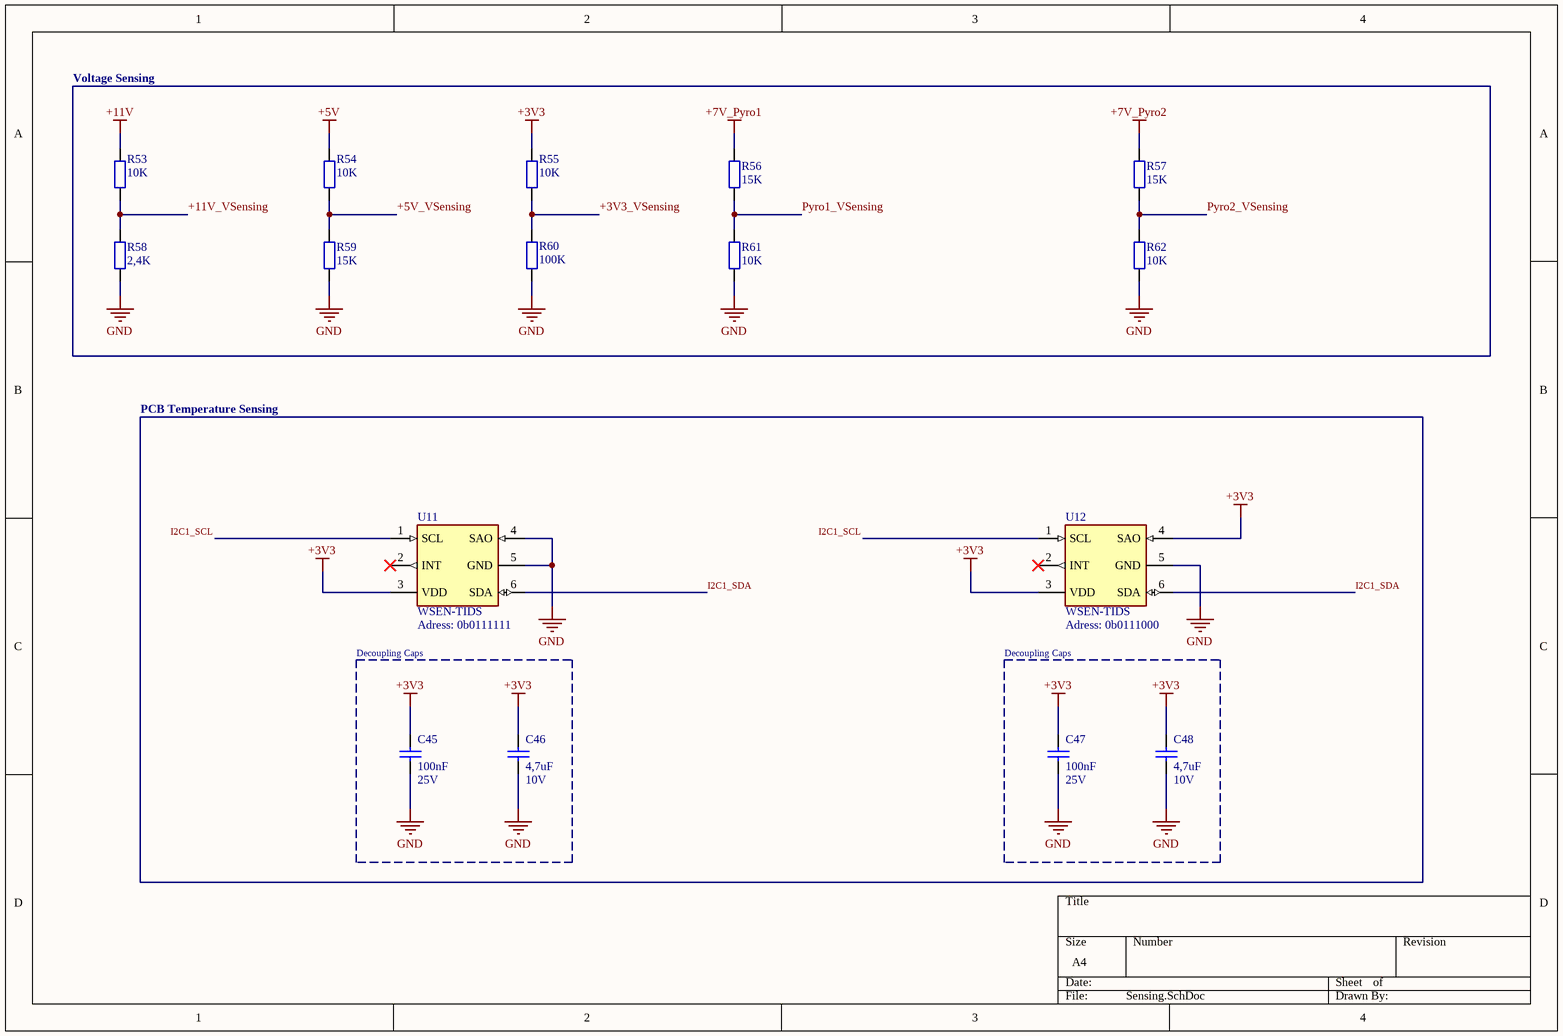
[diagram p5: Sensing.SchDoc]

### Parts
C45  value 100nF  Voltage: 25V  [MY_0603]  (hidden comment: Cap ceramic)
C46  value 4,7uF  Volte: 10V  [MY_0603]  (hidden comment: Cap ceramic)
C47  value 100nF  Voltage: 25V  [MY_0603]  (hidden comment: Cap ceramic)
C48  value 4,7uF  Volte: 10V  [MY_0603]  (hidden comment: Cap ceramic)
R53  10K  [R0603-0.45]
R54  10K  [R0603-0.45]
R55  10K  [R0603-0.45]
R56  15K  [R0603-0.45]
R57  15K  [R0603-0.45]
R58  2,4K  [R0603-0.45]
R59  15K  [R0603-0.45]
R60  100K  [R0603-0.45]
R61  10K  [R0603-0.45]
R62  10K  [R0603-0.45]
U11  WSEN-TIDS  [WSEN-TIDS-Footprint-1]
U12  WSEN-TIDS  [WSEN-TIDS-Footprint-1]

### Blocks framed on the sheet
Voltage Sensing: R53-R62
Decoupling Caps: C45 C46
Decoupling Caps: C47 C48

### Nets
+3V3: C45.2 C46.2 C47.2 C48.2 R55.1 U11.3(VDD) U12.3(VDD) U12.4(SAO)  [project net 3V3_Current-]
+5V: R54.1  [project net 5V_Current-]
+7V_Pyro1: R56.2  [project net Pyro1_Current-]
+7V_Pyro2: R57.2  [project net Pyro2_Current-]
+11V: R53.1  [project net 11V_Current-]
GND: C45.1 C46.1 C47.1 C48.1 R58.1 R59.1 R60.2 R61.2 R62.2 U11.4(SAO) U11.5(GND) U12.5(GND)
+3V3_VSensing: R55.2 R60.1
+5V_VSensing: R54.2 R59.2
+11V_VSensing: R53.2 R58.2
I2C1_SCL: U11.1(SCL) U12.1(SCL)
I2C1_SDA: U11.6(SDA) U12.6(SDA)
Pyro1_VSensing: R56.1 R61.1
Pyro2_VSensing: R57.1 R62.1

Not connected (* = marked no-connect by the designer): U11 2(INT)*; U12 2(INT)*

### Notes on the sheet
- PCB Temperature Sensing
- (near U11) Adress: 0b0111111
- (near U12) Adress: 0b0111000

### Library data of the parts
C45 C47 = CMP-015-000000-1: as C1 on sheet MCU
C46 C48 = CMP-015-000000-1: Capacitor, 4.7uF, 0603, 10V; ASiD Part Number: C-AS; Manufacturer: Wurth Elektronik; Manufacturer Part Number: 885012106012; Source: PCB_Project1.SCHLIB; Pin Count: 2; Design Item ID: Cap ceramic; Component Type: Standard
R53-R55 R61 R62 = R: as R1 on sheet MCU; Power Disipation: 0.1W; ClassName: 2PyroREG
R56 R57 R59 = CMP-009-000000-3: Resistor, 15K, 0603, 0.1W; Manufacturer: Wurth; Manufacturer Part Number: 560112116035; Power Disipation: 0.1
R58 = CMP-009-000000-3: Resistor, 2.4K, 0603, 0.1W; Manufacturer: Wurth; Manufacturer Part Number: 560112116061; Power Disipation: 0.1W
R60 = R: as R12 on sheet Power Management; Power Disipation: 0.1W; ClassName: REG5V
U11 U12 = CMP-010-00003-1: Analog Resistance Temperature Sensor; Manufacturer: Wurth Elektronik; Manufacturer Part Number: WSEN-TIDS

## Sheet Current Sensing.SchDoc
size A4; SheetNumber: 7; SheetTotal: 7
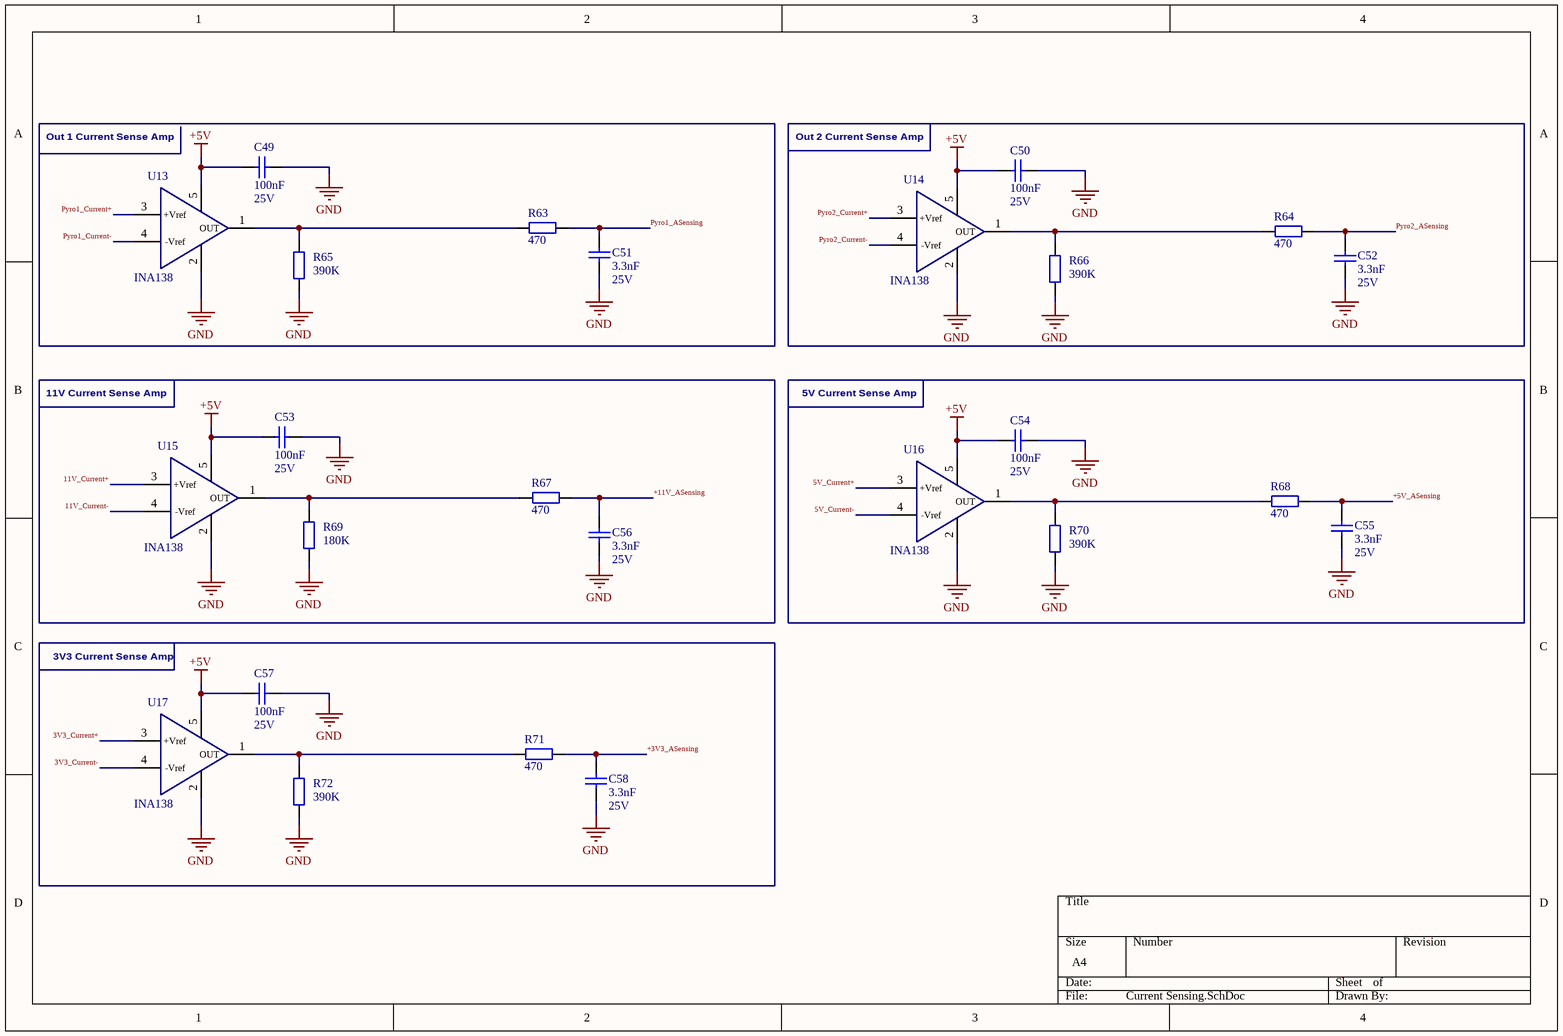
[diagram p6: Current Sensing.SchDoc]

### Parts
C49  value 100nF  Voltage: 25V  [MY_0603]  (hidden comment: Cap ceramic)
C50  value 100nF  Voltage: 25V  [MY_0603]  (hidden comment: Cap ceramic)
C51  value 3.3nF  Volte: 25V  [MY_0603]  (hidden comment: Cap ceramic)
C52  value 3.3nF  Volte: 25V  [MY_0603]  (hidden comment: Cap ceramic)
C53  value 100nF  Voltage: 25V  [MY_0603]  (hidden comment: Cap ceramic)
C54  value 100nF  Voltage: 25V  [MY_0603]  (hidden comment: Cap ceramic)
C55  value 3.3nF  Volte: 25V  [MY_0603]  (hidden comment: Cap ceramic)
C56  value 3.3nF  Volte: 25V  [MY_0603]  (hidden comment: Cap ceramic)
C57  value 100nF  Voltage: 25V  [MY_0603]  (hidden comment: Cap ceramic)
C58  value 3.3nF  Volte: 25V  [MY_0603]  (hidden comment: Cap ceramic)
R63  470  [R0603-0.45]
R64  470  [R0603-0.45]
R65  390K  [R0805-0.45]
R66  390K  [R0805-0.45]
R67  470  [R0603-0.45]
R68  470  [R0603-0.45]
R69  180K  [R0805-0.45]
R70  390K  [R0805-0.45]
R71  470  [R0603-0.45]
R72  390K  [R0805-0.45]
U13  INA138  [INA138-Footprint-1]
U14  INA138  [INA138-Footprint-1]
U15  INA138  [INA138-Footprint-1]
U16  INA138  [INA138-Footprint-1]
U17  INA138  [INA138-Footprint-1]

### Blocks framed on the sheet
Out 1 Current Sense Amp: C49 C51 R63 R65 U13
Out 2 Current Sense Amp: C50 C52 R64 R66 U14
11V Current Sense Amp: C53 C56 R67 R69 U15
5V Current Sense Amp: C54 C55 R68 R70 U16
3V3 Current Sense Amp: C57 C58 R71 R72 U17

### Nets
3V3_Current-: U17.4(-Vref)
5V_Current-: C49.2 C50.2 C53.2 C54.2 C57.2 U13.5(V+) U14.5(V+) U15.5(V+) U16.4(-Vref) U16.5(V+) U17.5(V+)  [also labelled +5V]
11V_Current+: U15.3(+Vref)
11V_Current-: U15.4(-Vref)
GND: C49.1 C50.1 C51.1 C52.1 C53.1 C54.1 C55.1 C56.1 C57.1 C58.1 R65.1 R66.1 R69.1 R70.1 R72.1 U13.2(GND) U14.2(GND) U15.2(GND) U16.2(GND) U17.2(GND)
Pyro1_Current-: U13.4(-Vref)
Pyro2_Current-: U14.4(-Vref)
3V3_Current+: U17.3(+Vref)
5V_Current+: U16.3(+Vref)
+3V3_ASensing: C58.2 R71.1
+5V_ASensing: C55.2 R68.1
+11V_ASensing: C56.2 R67.1
Pyro1_ASensing: C51.2 R63.1
Pyro1_Current+: U13.3(+Vref)
Pyro2_ASensing: C52.2 R64.1
Pyro2_Current+: U14.3(+Vref)
NetR63_2: R63.2 R65.2 U13.1(OUT)
NetR64_2: R64.2 R66.2 U14.1(OUT)
NetR67_2: R67.2 R69.2 U15.1(OUT)
NetR68_2: R68.2 R70.2 U16.1(OUT)
NetR71_2: R71.2 R72.2 U17.1(OUT)

### Library data of the parts
C49 C50 C53 C54 C57 = CMP-015-000000-1: as C1 on sheet MCU
  C49: ClassName: 1Pyro OPAMP
  C50: ClassName: 1PyroR OPAMP
  C53: ClassName: 11V OPAMP
  C54: ClassName: 5V OPAMP
  C57: ClassName: 3V3 OPAMP
C51 C52 C55 C56 C58 = CMP-015-000000-1: Capacitor, 3.3nF, 0603, 25V; Manufacturer: Wurth Elektronik; Manufacturer Part Number: 885012206062
R63 R64 R67 R68 R71 = CMP-009-000000-3: Resistor, 470R, 0603, 0.1W; Manufacturer: Wurth; Manufacturer Part Number: 560112116067; Power Disipation: 0.1W
R65 R66 R70 R72 = CMP-009-000000-3: Resistor, 400K, 0805, 125mW; Manufacturer: Wurth; Manufacturer Part Number: 560112116024; Power Disipation: 0.1W
  R65: ClassName: 1Pyro OPAMP
  R66: ClassName: 1PyroR OPAMP
  R70: ClassName: 5V OPAMP
  R72: ClassName: 3V3 OPAMP
R69 = CMP-009-000000-3: Resistor, 400K, 0805, 125mW; Manufacturer: Wurth; Manufacturer Part Number: 560112116072; Power Disipation: 0.1W; ClassName: 11V OPAMP
U13-U17 = CMP-014-00004-3: Shunt Current Measure Amplifier; Manufacturer: Texas Instruments; Manufacturer Part Number: INA138NA/3K
  U13: ClassName: 1Pyro OPAMP
  U14: ClassName: 1PyroR OPAMP
  U15: ClassName: 11V OPAMP
  U16: ClassName: 5V OPAMP
  U17: ClassName: 3V3 OPAMP

## Nets that join several sheets
3V3_Current-: Power Management (R21.2 R27.2), Connectors (5 pins), Sensing (8 pins), Current Sensing (U17.4)
5V_Current-: MCU (C15.2 U2.3), Power Management (5 pins), Drogue Pyro (C44.2 U10.5), Main Pyro (C37.2 U8.5), Connectors (5 pins), Sensing (R54.1), Current Sensing (11 pins)
11V_Current+: Power Management (D2.2 R15.1 R17.2 R24.2), Connectors (D9.1 P12.P P14.P), Current Sensing (U15.3)
11V_Current-: Power Management (8 pins), Connectors (P4.N P9.N P10.1 P15.1), Sensing (R53.1), Current Sensing (U15.4)
+3V3_C: MCU (20 pins), Power Management (C29.2 U6.5), Connectors (P16.4)
+11V_Pyro1: Main Pyro (C32.1 R34.2 U7.2), Connectors (P4.P)
+11V_Pyro_2: Drogue Pyro (C39.1 R44.2 U9.2), Connectors (P9.P)
+11VU: Power Management (D2.1 Q1.1 R12.1 R25.2), Connectors (P13.P)
GND: MCU (30 pins), Power Management (26 pins), Drogue Pyro (19 pins), Main Pyro (19 pins), Connectors (15 pins), Sensing (12 pins), Current Sensing (20 pins)
Pyro1_Current-: Main Pyro (5 pins), Sensing (R56.2), Current Sensing (U13.4)
Pyro2_Current-: Drogue Pyro (5 pins), Sensing (R57.2), Current Sensing (U14.4)
VS_GND: Power Management (D3.1 Q2.5), Connectors (P12.N P14.N)
3V3_Current+: Power Management (6 pins), Current Sensing (U17.3)
5V_Current+: Power Management (6 pins), Current Sensing (U16.3)
11V_1_EN: MCU (U1.40), Connectors (Q4.1 R32.1)
11V_2_EN: MCU (U1.41), Connectors (Q3.1 R31.1)
+3V3_ASensing: MCU (U1.28), Current Sensing (C58.2 R71.1)
+3V3_VSensing: MCU (U1.29), Sensing (R55.2 R60.1)
+5V_ASensing: MCU (U1.11), Current Sensing (C55.2 R68.1)
+5V_VSensing: MCU (U1.8), Sensing (R54.2 R59.2)
+11V_ASensing: MCU (U1.9), Current Sensing (C56.2 R67.1)
+11V_VSensing: MCU (U1.13), Sensing (R53.2 R58.2)
CAN_N: MCU (R7.1 U2.6), Connectors (D8.1 P1.1)
CAN_P: MCU (R7.2 U2.7), Connectors (D8.2 P1.2)
I2C1_SCL: MCU (U1.39), Sensing (U11.1 U12.1)
I2C1_SDA: MCU (U1.44), Sensing (U11.6 U12.6)
I2C2_SCL_N: MCU (R10.1 R11.1 U3.6), Connectors (P11.1)
I2C2_SCL_P: MCU (R9.2 R10.2 U3.7), Connectors (P11.2)
I2C2_SDA_N: MCU (R3.2 R4.2 U3.9), Connectors (P11.4)
I2C2_SDA_P: MCU (R4.1 R8.1 U3.8), Connectors (P11.3)
Pyro1_ASensing: MCU (U1.15), Current Sensing (C51.2 R63.1)
Pyro1_Current+: Main Pyro (6 pins), Current Sensing (U13.3)
Pyro1_DAC: MCU (U1.12), Main Pyro (U8.4)
Pyro1_VSensing: MCU (U1.10), Main Pyro (U8.3), Sensing (R56.1 R61.1)
Pyro1A_EN: MCU (U1.4), Main Pyro (Q5.4 R39.1 R41.2)
Pyro1B_EN: MCU (U1.17), Main Pyro (Q5.2 R40.1 R42.2)
Pyro1Reg_EN: MCU (U1.2), Main Pyro (JP1.1)
Pyro2_ASensing: MCU (U1.27), Current Sensing (C52.2 R64.1)
Pyro2_Current+: Drogue Pyro (6 pins), Current Sensing (U14.3)
Pyro2_DAC: MCU (U1.25), Drogue Pyro (U10.4)
Pyro2_VSensing: MCU (U1.26), Drogue Pyro (U10.3), Sensing (R57.1 R62.1)
Pyro2A_EN: MCU (U1.18), Drogue Pyro (Q6.2 R49.1 R51.2)
Pyro2B_EN: MCU (U1.22), Drogue Pyro (Q6.4 R50.1 R52.2)
Pyro2Reg_EN: MCU (U1.43), Drogue Pyro (JP2.1)
SWCLK: MCU (U1.38), Connectors (D10.2 P16.1)
SWDIO: MCU (U1.37), Connectors (D10.1 P16.3)